# Altium schematic sheet SH2 - CONNECTORS.SchDoc: Power Distribution Board Rev2 - Connectors
size Letter; DrawnBy: Cindy Li; Organization: UW Robotics; Address1: 200 University Avenue; Address2: Waterloo; Address3: Ontario; Address4: Canada N2L 3G6; DocumentNumber: 2; SheetNumber: 2; SheetTotal: 11
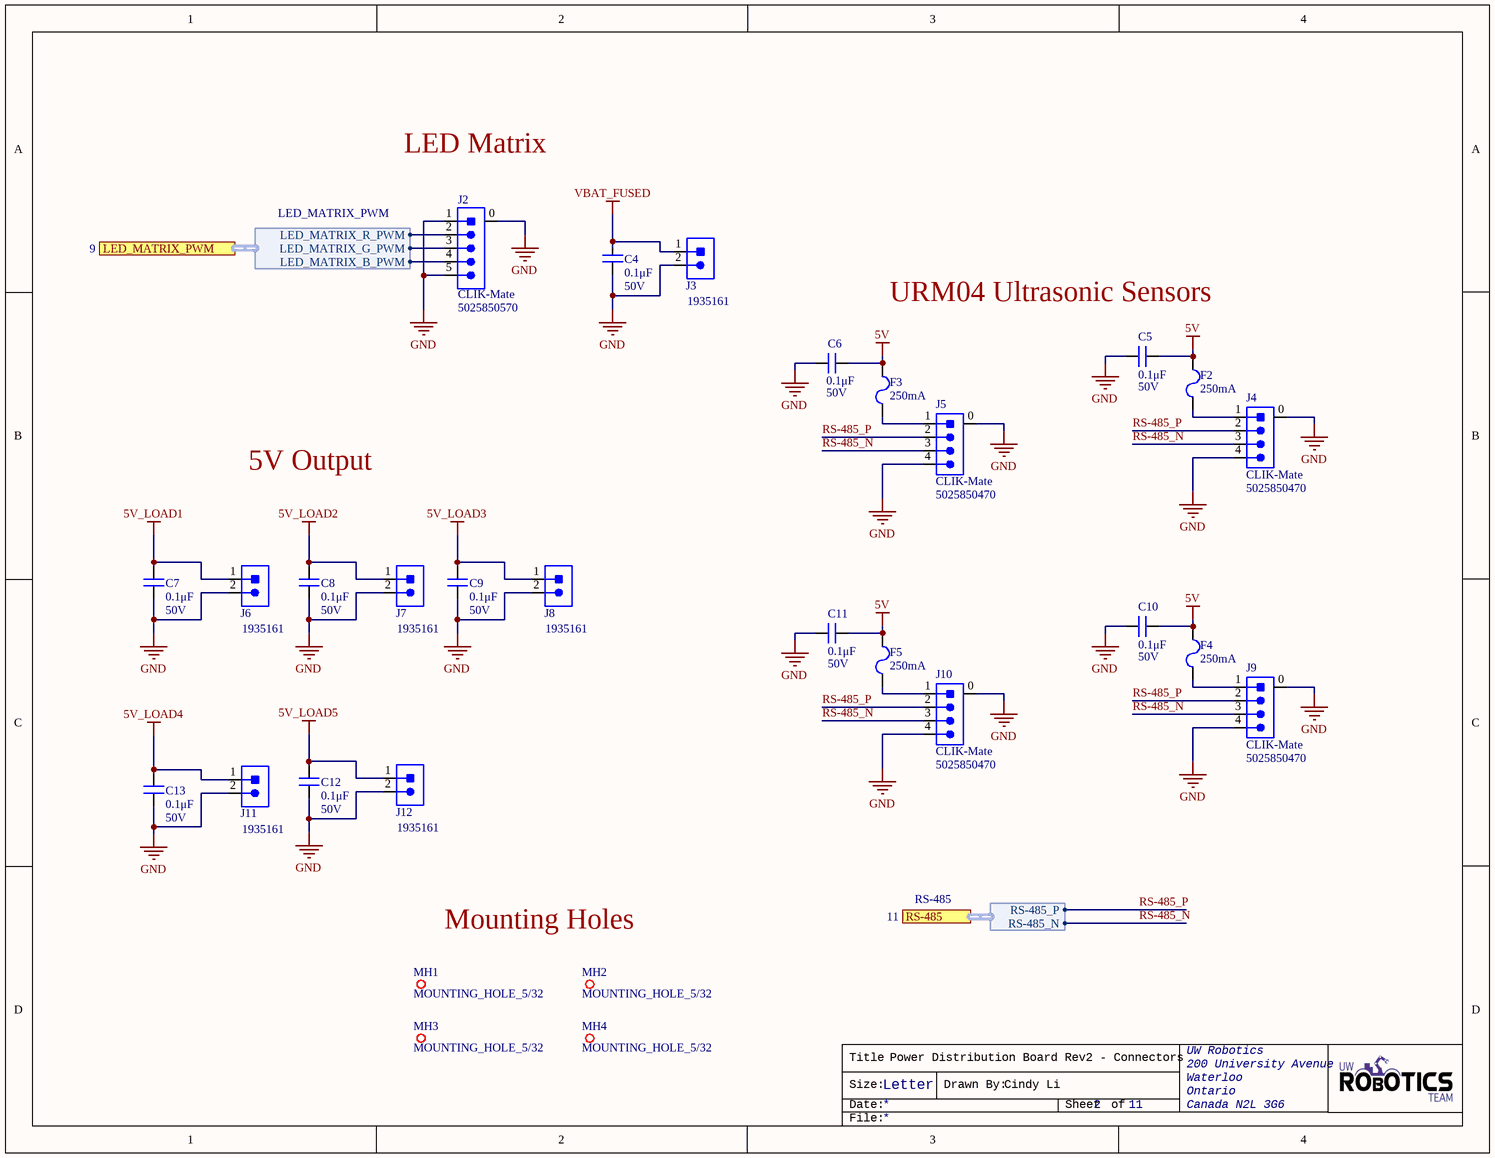
[diagram p0: SH2 - CONNECTORS.SchDoc]

## Parts
C4  0.1μF  Voltage Rating: 50V  [CAP2012]
C5  value 0.1μF  Voltage Rating: 50V  [CAP0603]  (hidden comment: CAP_0.1uF_50V_0603)
C6  value 0.1μF  Voltage Rating: 50V  [CAP0603]  (hidden comment: CAP_0.1uF_50V_0603)
C7  0.1μF  Voltage Rating: 50V  [CAP2012]
C8  0.1μF  Voltage Rating: 50V  [CAP2012]
C9  0.1μF  Voltage Rating: 50V  [CAP2012]
C10  value 0.1μF  Voltage Rating: 50V  [CAP0603]  (hidden comment: CAP_0.1uF_50V_0603)
C11  value 0.1μF  Voltage Rating: 50V  [CAP0603]  (hidden comment: CAP_0.1uF_50V_0603)
C12  0.1μF  Voltage Rating: 50V  [CAP2012]
C13  0.1μF  Voltage Rating: 50V  [CAP2012]
F2  Current Rating: 250mA  [FUSE_0603]  (hidden comment: FUSE_250mA_0603)
F3  Current Rating: 250mA  [FUSE_0603]  (hidden comment: FUSE_250mA_0603)
F4  Current Rating: 250mA  [FUSE_0603]  (hidden comment: FUSE_250mA_0603)
F5  Current Rating: 250mA  [FUSE_0603]  (hidden comment: FUSE_250mA_0603)
J2  Family: CLIK-Mate  Manufacturer Part Number 1: 5025850570  [MOLEX-5025850570]  (hidden comment: CON_5M_SM_RA)
J3  1935161  [1935161]
J4  Family: CLIK-Mate  Manufactor Number: 5025850470  [MOLEX-5025850470]  (hidden comment: CON_4M_SM_RA)
J5  Family: CLIK-Mate  Manufactor Number: 5025850470  [MOLEX-5025850470]  (hidden comment: CON_4M_SM_RA)
J6  1935161  [1935161]
J7  1935161  [1935161]
J8  1935161  [1935161]
J9  Family: CLIK-Mate  Manufactor Number: 5025850470  [MOLEX-5025850470]  (hidden comment: CON_4M_SM_RA)
J10  Family: CLIK-Mate  Manufactor Number: 5025850470  [MOLEX-5025850470]  (hidden comment: CON_4M_SM_RA)
J11  1935161  [1935161]
J12  1935161  [1935161]
MH1  MOUNTING_HOLE_5/32  [MOUNTING_HOLE_5/38]
MH2  MOUNTING_HOLE_5/32  [MOUNTING_HOLE_5/38]
MH3  MOUNTING_HOLE_5/32  [MOUNTING_HOLE_5/38]
MH4  MOUNTING_HOLE_5/32  [MOUNTING_HOLE_5/38]

## Ports
LED_MATRIX_PWM (harness LED_MATRIX_PWM, see 9), RS-485 (harness RS-485, see 11)

## Harnesses
LED_MATRIX_PWM: LED_MATRIX_R_PWM, LED_MATRIX_G_PWM, LED_MATRIX_B_PWM
RS-485: RS-485_P, RS-485_N

## Nets
5V: C5.2 C6.2 C10.2 C11.2 F2.2 F3.2 F4.2 F5.2
5V_LOAD1: C7.2 J6.1
5V_LOAD2: C8.2 J7.1
5V_LOAD3: C9.2 J8.1
5V_LOAD4: C13.2 J11.1
5V_LOAD5: C12.2 J12.1
GND: C4.1 C5.1 C6.1 C7.1 C8.1 C9.1 C10.1 C11.1 C12.1 C13.1 J2.0 J2.1 J2.5 J3.2 J4.0 J4.4 J5.0 J5.4 J6.2 J7.2 J8.2 J9.0 J9.4 J10.0 J10.4 J11.2 J12.2
VBAT_FUSED: C4.2 J3.1
RS-485_N: J4.3 J5.3 J9.3 J10.3 ; port RS-485.RS-485_N
RS-485_P: J4.2 J5.2 J9.2 J10.2 ; port RS-485.RS-485_P
NetF2_1: F2.1 J4.1
NetF3_1: F3.1 J5.1
NetF4_1: F4.1 J9.1
NetF5_1: F5.1 J10.1
NetJ2_2: J2.2 ; port LED_MATRIX_PWM.LED_MATRIX_R_PWM
NetJ2_3: J2.3 ; port LED_MATRIX_PWM.LED_MATRIX_G_PWM
NetJ2_4: J2.4 ; port LED_MATRIX_PWM.LED_MATRIX_B_PWM

## Notes on the sheet
- LED Matrix
- URM04 Ultrasonic Sensors
- 5V Output
- Mounting Holes
- Title
- Size:
- Date:
- Letter
- Drawn By:
- Sheet
- of
- File:

## Library data of the parts
C4 C7-C9 C12 C13 = CAP_0.1uF_50V_0805: CAP CER 0.1UF 50V X7R 0805; Manufacturer 1: Murata Electronics; Manufacturer Part Number 1: GCD21BR71H104KA01L; Tolerance: 10%; Mount: Surface Mount; Case Code (Metric): 2012; Case Code (Imperial): 0805; Min Operating Temperature: -55°C; Max Operating Temperature: 125°C; Dielectric: X7R; Termination: SMD/SMT; Length: 2mm; Height: 1.25mm; Width: 0.049inch; Thickness: 0.049inch; Depth: 1.25mm; Ratings: AEC-Q200; Supplier 1: Digi-Key; Supplier Part Number 1: 490-11955-1-ND; Package: 0805 (2012 Metric); Value: 0.1μF
C5 C6 C10 C11 = CAP_0.1uF_50V_0603: CAP CER 0.1UF 50V X7R 0603; Manufacturer Part Number 1: CC0603KRX7R9BB104; Manufacturer 1: Yageo; Dimensions: 0.063" L x 0.031" W (1.60mm x 0.80mm); Package: 0603 (1608 Metric); Temperature Coefficient: X7R; Supplier Part Number 1: 311-1344-1-ND; Supplier 1: Digi-Key; Mount: Surface Mount; Case Code (Imperial): 0603; Case Code (Metric): 1608; Dielectric: X7R
F2-F5 = FUSE_250mA_0603: FUSE SMD 250mA 32V; Manufacturer 1: Littelfuse; Manufacturer Part Number 1: 0467.250NRHF; Response Time: Fast Blow; Voltage Rating (AC): 32V; Voltage Rating (DC): 32V; Supplier 1: Digi-Key; Supplier Packaging 1: Cut Tape; Mount: Surface Mount; Supplier Part Number 1: F6020CT-ND
J2 = CON_5M_SM_RA: CONN HEADER SMD RIGHT ANGLE 1.5MM PITCH; Manufacturer 1: Molex; Connector Type: Receptacle,Center Strip Contact; Number of Positions: 5; Current Rating: 2A; Supplier 1: Digi-Key; Supplier Part Number 1: WM14469CT-ND; Mount: Surface Mount; Termination: Solder; Number of Contacts: 5; Orientation: Right Angle; Number of Circuits: 5; Number of Rows: 1
J3 J6-J8 J11 J12 = CON_2M_TERM: TERM BLK 2POS SIDE ENTRY 5MM; Manufacturer 1: Phoenix Contact; Connector Type: Screw; Voltage Rating (DC): 320V; Max Current Rating: 16A; Max Supply Voltage: 250V; Current Rating: 17.5A; Number of Poles: 2; Number of Levels: 1; Current: 18A; Voltage: 300V; Wire Gauge (Max): 26AWG; Wire Gauge (Min): 12AWG; Approvals: UL; Supplier 1: Digi-Key; Mount: Through Hole; Number of Pins: 2; Weight: 0.067021oz; Contact Material: Copper,Tin; Insulation Material: Nylon; Housing Material: Polyamide; Housing Color: Green; Color: Green; Material: Nylon; Number of Rows: 1; Voltage Rating: 250V; Number of Positions: 2; Number of Positions Per Level: 2; Termination: Solder; Number of Contacts: 2; Number of Circuits: 2; Orientation: Straight; Length: 9mm; Height: 11.3mm; Width: 14.9mm; Pitch: 5mm; Depth: 9mm; Wire/Cable Gauge: 26AWG; Flammability Rating: UL94 V-0; REACH SVHC: Unknown; Supplier Part Number 1: 277-1667-ND; Manufacturer Part Number 1: 1935161
J4 J5 J9 J10 = CON_4M_SM_RA: CONN HEADER SMD RIGHT ANGLE 1.5 MM PITCH; Manufacturer: Molex; Supplier 1: Digi-Key; Supplier Part Number 1: WM9449CT-ND